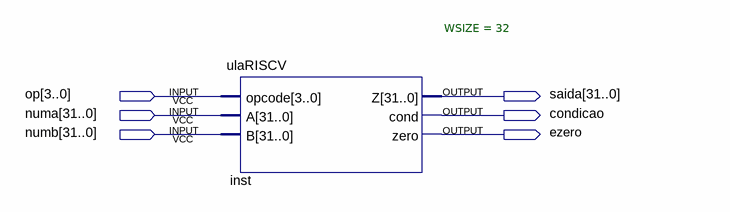
[diagram p0: schematic sheet]
// Quartus schematic teste.bdf as structural Verilog: 1 symbols, 6 pins
module teste (
  input  [3:0] op,
  input  [31:0] numa,
  input  [31:0] numb,
  output [31:0] saida,
  output condicao,
  output ezero
);

  ulaRISCV #(.WSIZE(32)) inst (.opcode(op), .A(numa), .B(numb), .Z(saida), .cond(condicao), .zero(ezero));
endmodule
